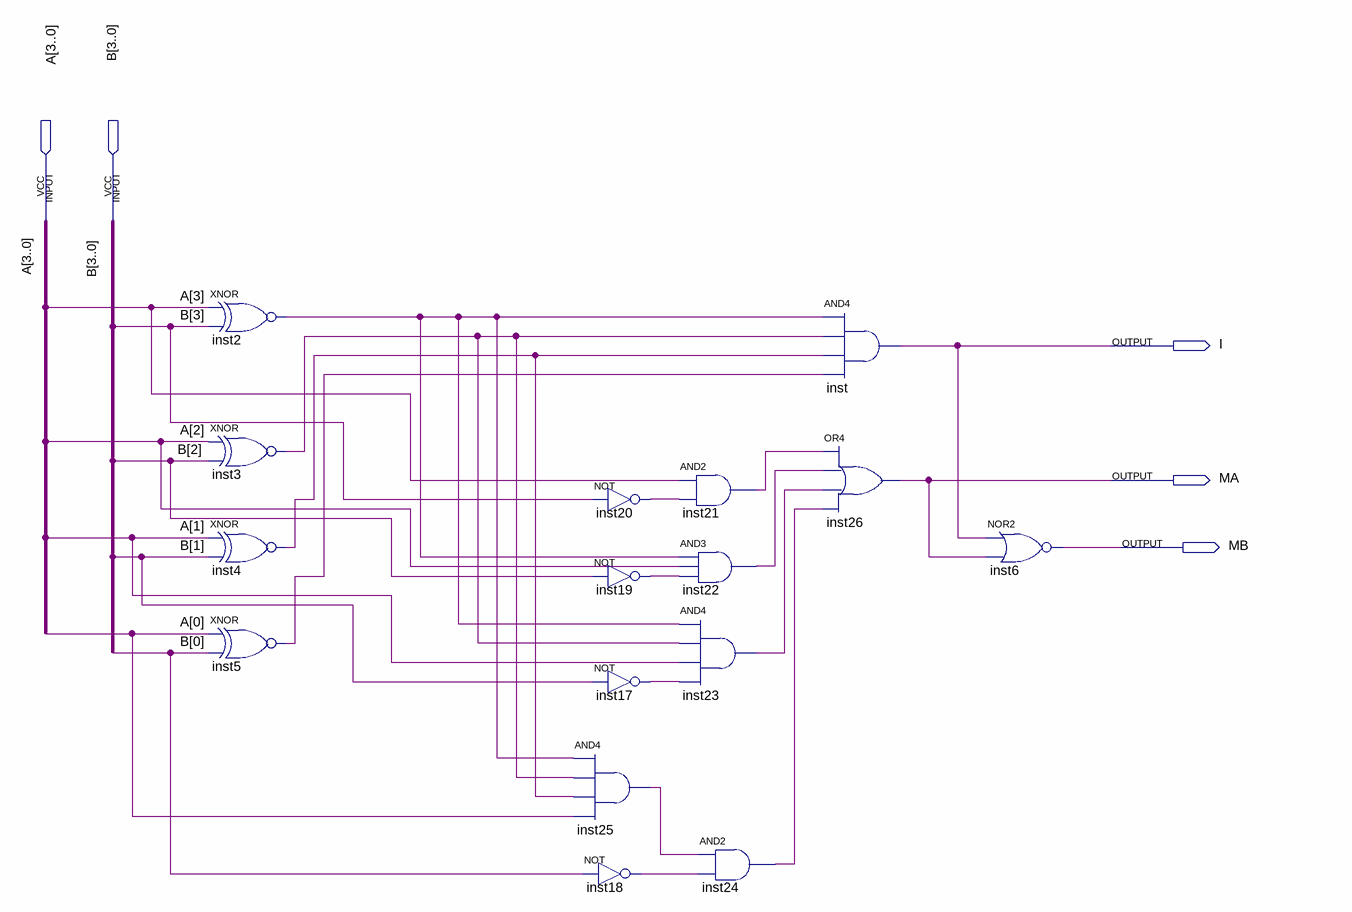
[diagram p0: schematic sheet]
// Quartus schematic comparador_decisao.bdf as structural Verilog: 16 symbols, 5 pins
module comparador_decisao (
  input  [3:0] A,
  input  [3:0] B,
  output I,
  output MA,
  output MB
);

  wire inst2_out, inst3_out, inst4_out, inst5_out, inst17_out, inst18_out, inst19_out, inst20_out,
       inst21_out, inst22_out, inst23_out, inst24_out, inst25_out;

  xnor inst2 (inst2_out, A[3], B[3]);
  xnor inst3 (inst3_out, A[2], B[2]);
  xnor inst4 (inst4_out, A[1], B[1]);
  xnor inst5 (inst5_out, A[0], B[0]);
  not inst20 (inst20_out, B[3]);
  not inst19 (inst19_out, B[2]);
  not inst17 (inst17_out, B[1]);
  and inst25 (inst25_out, inst2_out, inst3_out, inst4_out, A[0]);
  not inst18 (inst18_out, B[0]);
  and inst21 (inst21_out, A[3], inst20_out);
  and inst22 (inst22_out, inst2_out, A[2], inst19_out);
  and inst23 (inst23_out, inst2_out, inst3_out, A[1], inst17_out);
  and inst24 (inst24_out, inst25_out, inst18_out);
  and inst (I, inst2_out, inst3_out, inst4_out, inst5_out);
  or inst26 (MA, inst21_out, inst22_out, inst23_out, inst24_out);
  nor inst6 (MB, I, MA);
endmodule
